# Altium project _A_D.000000.001.PrjPCB
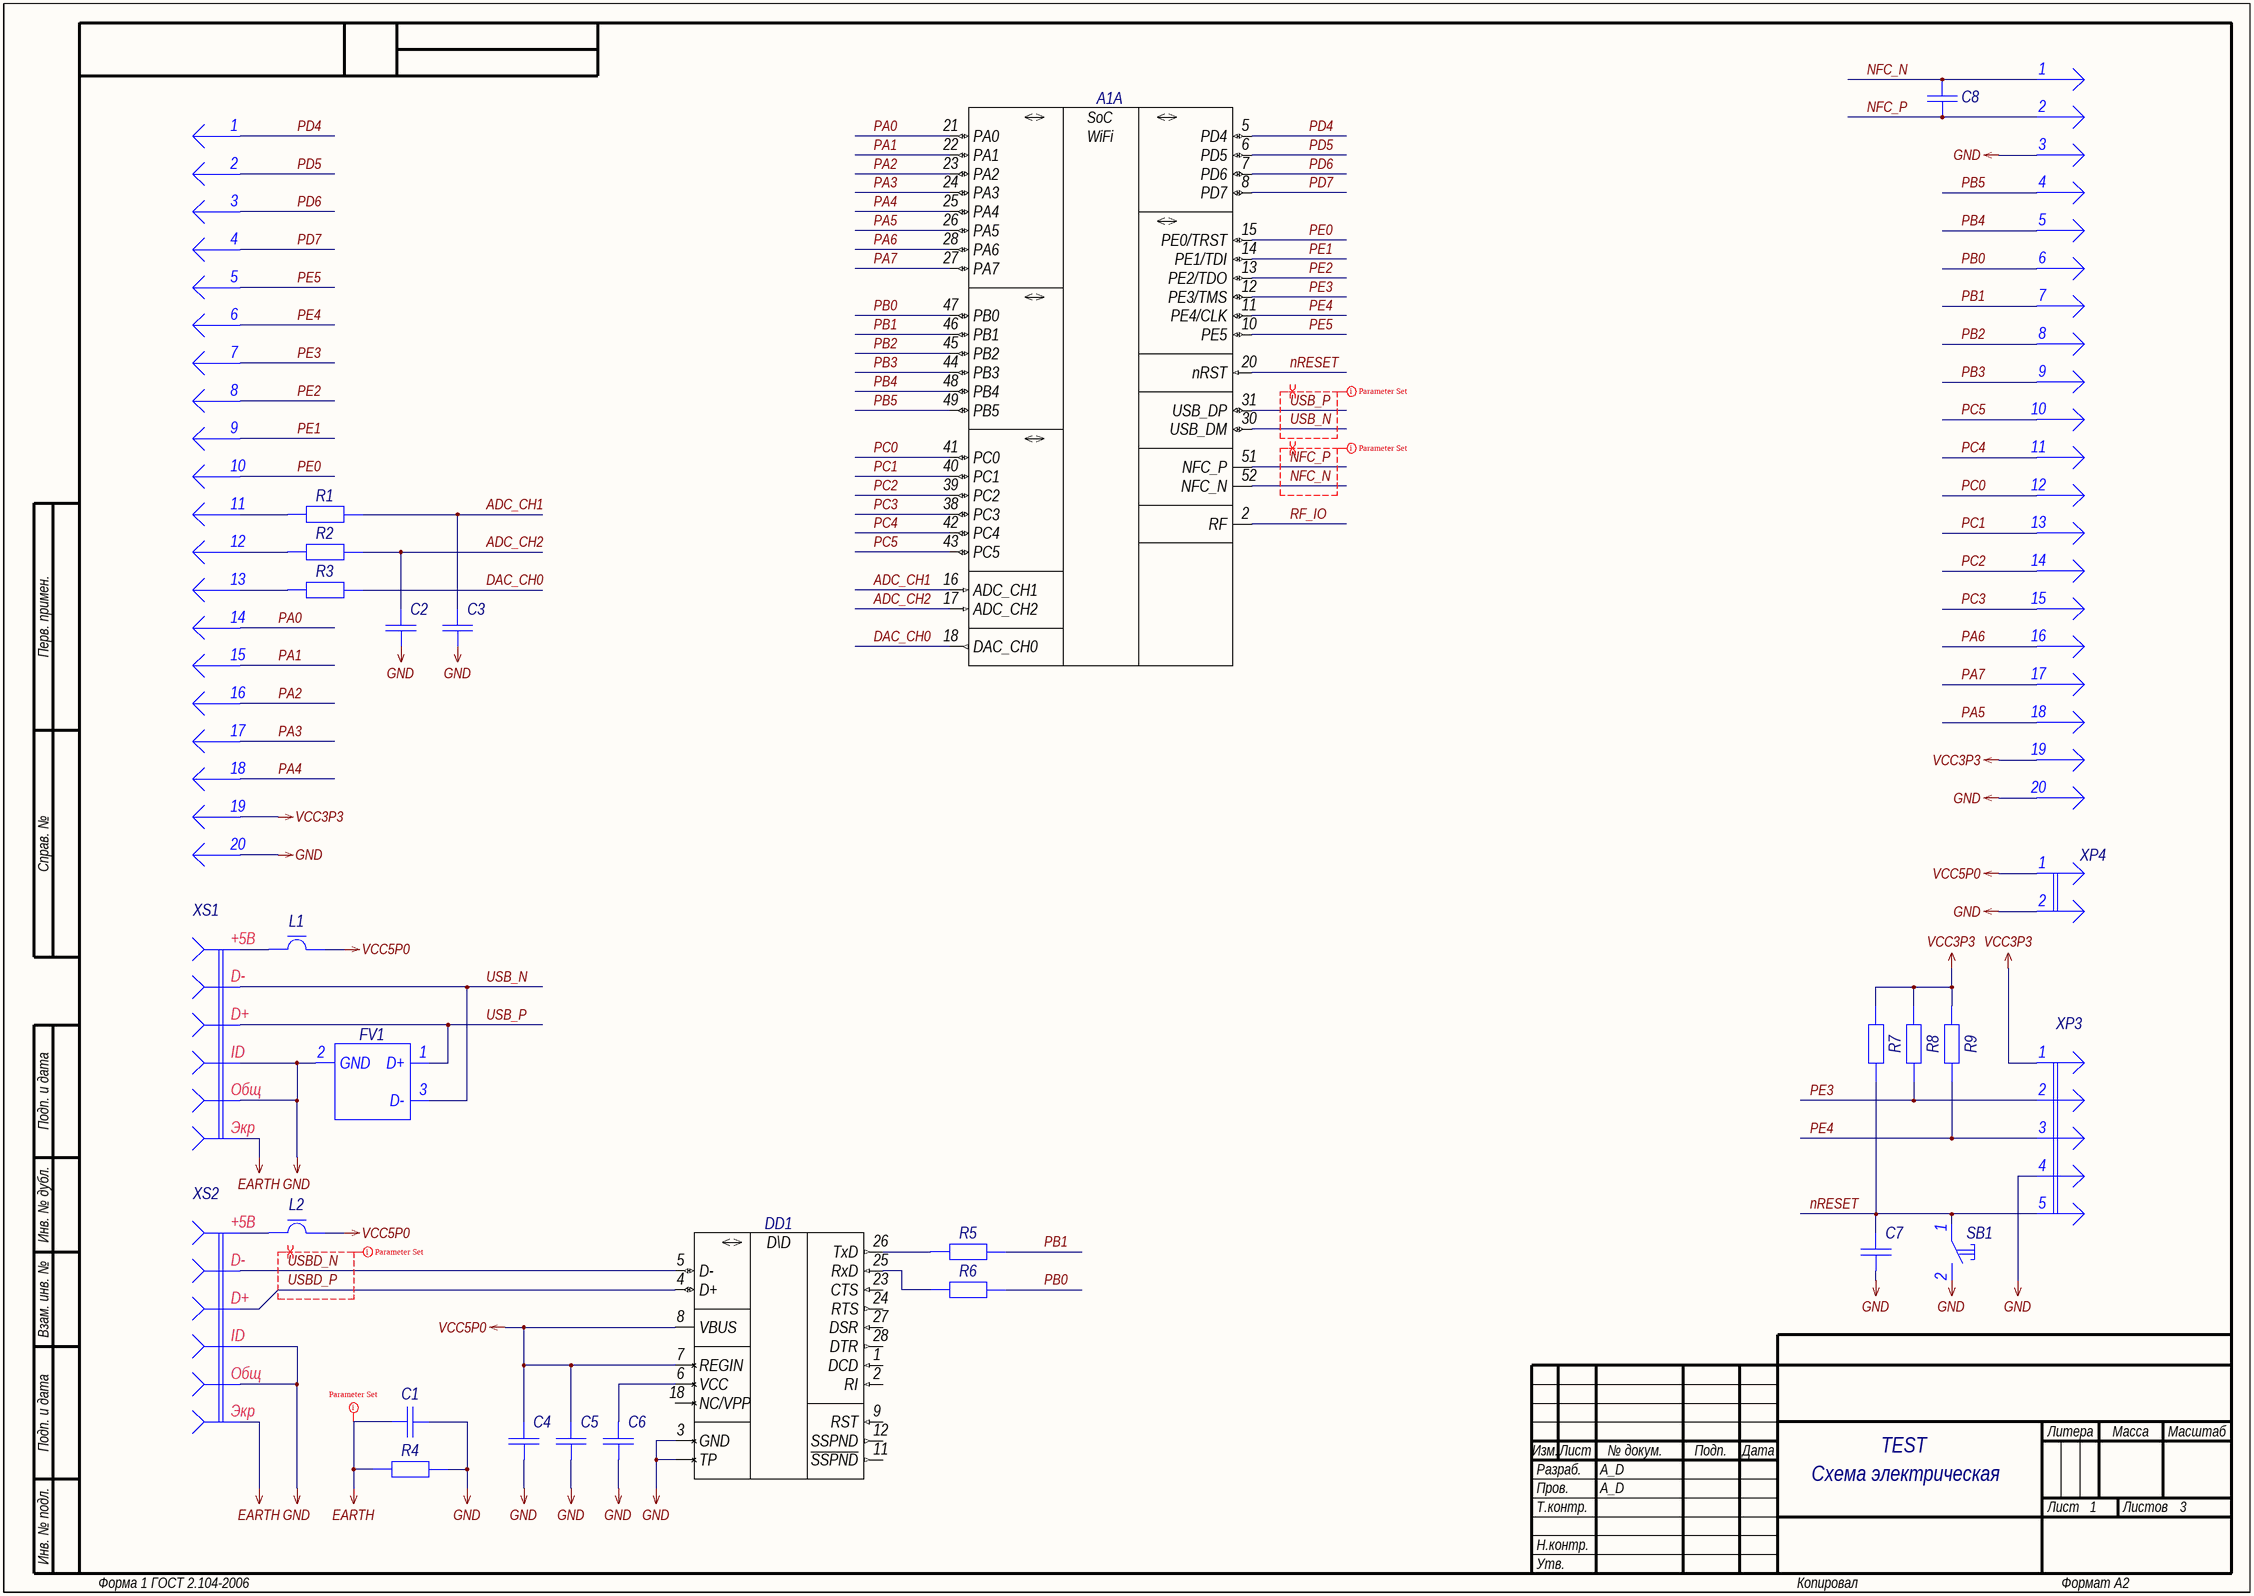
[diagram p0: 01_MAIN.SchDoc]
GlobalOrganizationName: A_D Electronics; GlobalProjectName: TEST; GlobalProjectNumber: A_D.000000.001; GlobalProjectRevision: 1
3 sheets, 81 parts. Net scope: global (net labels, ports and power ports of the same name join across sheets).
Board file: BOARD.PcbDoc
Sheets:
  01_MAIN.SchDoc
  02_ETHERNET.SchDoc
  03_POWER.SchDoc

## Sheet 01_MAIN.SchDoc: =GlobalProjectName
size 594 x 420 mm; CheckedBy: A_D; Author: A_D; Organization: A_D Electronics; DocumentNumber: A_D.000000.001 Э3; Revision: 1; SheetNumber: 1; SheetTotal: 3; PageSetup: Record=PageOptions|CenterHorizontal=True|CenterVertical=True|PrintScale=0.70|XCorrection=1.00|YCorrection=1.00|PrintKind=2|BorderSize=5000000|LeftOffset=9000|BottomOffset=10100|Orientation=2|PaperLength=11176|PaperWidth=8636|Scale=100|PaperSource=259|PrintQuality=-3|MediaType=1|DitherType=10|PrintScaleMode=1|PaperKind=A3|PaperIndex=8; FirstApplication: A_D.000000.001; DocumentName: TEST

### Parts
A1  AMB-02  [AMB-02]  (value not drawn)  (part A of 2)
C1  Capacitor  [C0603_L]  (value not drawn)
C2  Capacitor  [C0603_L]  (value not drawn)
C3  Capacitor  [C0603_L]  (value not drawn)
C4  Capacitor  [C0603_L]  (value not drawn)
C5  Capacitor  [C0603_L]  (value not drawn)
C6  Capacitor  [C0603_L]  (value not drawn)
C7  Capacitor  [C0603_L]  (value not drawn)
C8  Capacitor  [C0603_L]  (value not drawn)
DD1  CP2102_9  [QFN-28_050P500X500X100_N]  (value not drawn)
FV1  TPD2EUSB30DRT  [SOT-3_070P100X080X050_N]  (value not drawn)
L1  FerriteBead  [L0805_L]  (value not drawn)
L2  FerriteBead  [L0805_L]  (value not drawn)
R1  Resistor  [R0603_L]  (value not drawn)
R2  Resistor  [R0603_L]  (value not drawn)
R3  Resistor  [R0603_L]  (value not drawn)
R4  Resistor  [R0603_L]  (value not drawn)
R5  Resistor  [R0603_L]  (value not drawn)
R6  Resistor  [R0603_L]  (value not drawn)
R7  Resistor  [R0603_L]  (value not drawn)
R8  Resistor  [R0603_L]  (value not drawn)
R9  Resistor  [R0603_L]  (value not drawn)
SB1  RESET  [IT-1185AP]  (value not drawn)
XP1  Text  [PLS-20]  (value not drawn)  (parts A,B,C,D,E,F,G,H,I,J,K,L,M,N,O,P,Q,R,S,T of 20)
XP2  Text  [PLS-20]  (value not drawn)  (parts A,B,C,D,E,F,G,H,I,J,K,L,M,N,O,P,Q,R,S,T of 20)
XP3  Text  [PLS-5]  (value not drawn)
XP4  Text  [PLS-2]  (value not drawn)
XS1  Text  [1981568-1]  (value not drawn)
XS2  Text  [1981568-1]  (value not drawn)

### Nets
EARTH: C1.2 R4.1 XS1.6 XS2.6
GND: C1.1 C2.1 C3.1 C4.1 C5.1 C6.1 C7.1 DD1.3(GND) DD1.TP FV1.2(GND) R4.2 SB1.2 XP1.20 XP2.3 XP2.20 XP3.4 XP4.2 XS1.4 XS1.5 XS2.4 XS2.5
VCC3P3: R7.2 R8.2 R9.2 XP1.19 XP2.19 XP3.1
VCC5P0: C4.2 C5.2 DD1.7(REGIN) DD1.8(VBUS) L1.2 L2.2 XP4.1
ADC_CH1: A1.16(ADC_CH1) C3.2 R1.2
ADC_CH2: A1.17(ADC_CH2) C2.2 R2.2
DAC_CH0: A1.18(DAC_CH0) R3.2
NFC_N: A1.52(NFC_N) C8.2 XP2.1
NFC_P: A1.51(NFC_P) C8.1 XP2.2
nRESET: A1.20(nRST) C7.2 R7.1 SB1.1 XP3.5
PA0: A1.21(PA0) XP1.14
PA1: A1.22(PA1) XP1.15
PA2: A1.23(PA2) XP1.16
PA3: A1.24(PA3) XP1.17
PA4: A1.25(PA4) XP1.18
PA5: A1.26(PA5) XP2.18
PA6: A1.28(PA6) XP2.16
PA7: A1.27(PA7) XP2.17
PB0: A1.47(PB0) R6.2 XP2.6
PB1: A1.46(PB1) R5.2 XP2.7
PB2: A1.45(PB2) XP2.8
PB3: A1.44(PB3) XP2.9
PB4: A1.48(PB4) XP2.5
PB5: A1.49(PB5) XP2.4
PC0: A1.41(PC0) XP2.12
PC1: A1.40(PC1) XP2.13
PC2: A1.39(PC2) XP2.14
PC3: A1.38(PC3) XP2.15
PC4: A1.42(PC4) XP2.11
PC5: A1.43(PC5) XP2.10
PD4: A1.5(PD4) XP1.1
PD5: A1.6(PD5) XP1.2
PD6: A1.7(PD6) XP1.3
PD7: A1.8(PD7) XP1.4
PE0: A1.15(PE0/TRST) XP1.10
PE1: A1.14(PE1/TDI) XP1.9
PE2: A1.13(PE2/TDO) XP1.8
PE3: A1.12(PE3/TMS) R8.1 XP1.7 XP3.2
PE4: A1.11(PE4/CLK) R9.1 XP1.6 XP3.3
PE5: A1.10(PE5) XP1.5
RF_IO: A1.2(RF)
USB_N: A1.30(USB_DM) FV1.3(D-) XS1.2
USB_P: A1.31(USB_DP) FV1.1(D+) XS1.3
USBD_N: DD1.5(D-) XS2.2
USBD_P: DD1.4(D+) XS2.3
NetC6_2: C6.2 DD1.6(VCC)
NetDD1_25: DD1.25(RxD) R6.1
NetDD1_26: DD1.26(TxD) R5.1
NetL1_1: L1.1 XS1.1
NetL2_1: L2.1 XS2.1
NetR1_1: R1.1 XP1.11
NetR2_1: R2.1 XP1.12
NetR3_1: R3.1 XP1.13

Not connected (* = marked no-connect by the designer): DD1 1(DCD) 2(RI) 9(RST) 11(~{SSPND}) 12(SSPND) 18(NC/VPP) 23(CTS) 24(RTS) 27(DSR) 28(DTR)

### Layout directives
differential pair: NFC_N, NFC_P, USB_N, USB_P, USBD_N, USBD_P
net class USBD; rule Matched Net Lengths [Tolerance = 1mm]: USBD_N, USBD_P
net class USB; rule Matched Net Lengths [Tolerance = 1mm]: USB_N, USB_P
net class NFC; rule Matched Net Lengths [Tolerance = 1mm]: NFC_N, NFC_P
rule Polygon Connect Style [Style - Direct Connect]: EARTH

### Notes on the sheet
- Схема электрическая
  принципиальная
- Перв. примен.
- Справ. №
- Подп. и дата
- Инв. № дубл.
- Взам. инв. №
- Разраб.
- Изм.
- Лист
- № докум.
- Подп.
- Дата
- Литера
- Масса
- Масштаб
- Пров.
- Т.контр.
- Листов
- Инв. № подл.
- Н.контр.
- Утв.
- Форма 1 ГОСТ 2.104-2006
- Копировал
- Формат А2
- (in symbol 1981568-1) +5В; D-; D+; ID; Общ; Экр
- (in symbol CP2102-GM) D\D
- (in symbol MJIOT-AMB-02, part A) SoC; WiFi

### Library data of the parts
A1 = MJIOT-AMB-02: Manufacturer: MJIOT; ID: 3; Supply Operation: +3.0…3.6V; Supply Current: 450mA; ROM/RAM: 1MB/2MB+512KB; Wireless Compatibility: 802.11 b/g/n; Supported Interfaces: JTAG, SWD, SPI, I2C, I2S, UART, PWM, PCM, SDIO, NFC, ADC, DAC, USB HS, MII/RMII; I/O Lines: 30; Operation Frequency: 166MHz; Application Category: 1; Working Temperature Min: -20°С; Working Temperature Max: +85°С; Published: 12.12.2017; Publisher: Andrew Danich; Type: Модуль; Part Number: MJIOT-AMB-02; Value: MJIOT-AMB-02
C1 C5-C7 = GRM188R72A104KA35D: Manufacturer: Murata; Type: Конденсатор; ID: 232; Value: 0.1uF; Voltage: 100V; Tolerance: ±10%; Dielectric Type: X7R; Application Category: 1; Working Temperature Min: -55°С; Working Temperature Max: +125°С; Published: 18.05.2010; Publisher: Andrew Danich; Part Number: GRM188R72A104KA35D; Footprint: 0603
  C1: ClassName: DirectConnect
C2 C3 = GCM1885C2A101JA16D: Manufacturer: Murata; Type: Конденсатор; ID: 155; Value: 100pF; Voltage: 100V; Tolerance: ±5%; Dielectric Type: NP0; Application Category: 1; Working Temperature Min: -55°С; Working Temperature Max: +125°С; Published: 18.05.2010; Publisher: Andrew Danich; Part Number: GCM1885C2A101JA16D; Footprint: 0603
C4 = GCM188R71E105KA64D: Manufacturer: Murata; Type: Конденсатор; ID: 134; Value: 1uF; Voltage: 25V; Tolerance: ±10%; Dielectric Type: X7R; Application Category: 1; Working Temperature Min: -55°С; Working Temperature Max: +85°С; Published: 18.05.2010; Publisher: Andrew Danich; Part Number: GCM188R71E105KA64D; Footprint: 0603
C8 = GRM1885C2A8R2DA01D: Manufacturer: Murata; Type: Конденсатор; ID: 215; Value: 8.2pF; Voltage: 100V; Tolerance: ±0.5pF; Dielectric Type: NP0; Application Category: 1; Working Temperature Min: -55°С; Working Temperature Max: +125°С; Published: 18.05.2010; Publisher: Andrew Danich; Part Number: GRM1885C2A8R2DA01D; Footprint: 0603
DD1 = CP2102-GM: Single Chip USB to UART Bridge; Manufacturer: Silicon Labs; ID: 4; Supply Operation: +3.3V; Supply Current: 13.7mA; USB Type Support: USB 2.0; USB Speed Support: 12 Mb/s; OTG Support: No; Channels: 1; Working Temperature Min: -40°C; Working Temperature Max: +85°C; Published: 03.08.2015; Publisher: Andrew Danich; Type: Микросхема; Part Number: CP2102-GM; Value: CP2102-GM; Input Interface: UART; Application Category: 1; Functional Analog: -
FV1 = TPD2EUSB30DRT: Manufacturer: Texas Instruments; ID: 5; Breakdown Voltage: 7V; Reverse Stand Off Voltage: 5.5V; Forward Voltage: 0.95V; Peak Forward Current: 5A; Junction Capacitance: 0.8pF; Pulse Power Dissipation: 45W; Directional: Bidirectional; Application Category: 1; Working Temperature Min: -40°С; Working Temperature Max: +85°С; Published: 27.12.2015; Publisher: Andrew Danich; Type: Супрессор; Part Number: TPD2EUSB30DRT; Value: TPD2EUSB30DRT; Functional Analog: -
L1 L2 = BLM21PG331SN1: Manufacturer: Murata; Type: Дроссель; ID: 2; Rated Current: 1.5A; Impedance at 100Mhz: 330ohm; DC Resistance: 0.07ohm; Inductor Type: EMIFIL; Application Category: 1; Working Temperature Min: -55°С; Working Temperature Max: +125°С; Published: 14.11.2014; Publisher: Andrew Danich; Part Number: BLM21PG331SN1; Value: BLM21PG331SN1; Footprint: 0805; ClassName: DirectConnect
R1 R2 = RC0603JR-07100R: Manufacturer: Yageo; ID: 10; Value: 100; Limit Voltage: 50V; Tolerance: ±5%; Temperature Coefficient: 100ppm; Total Power Dissipation: 0.1W; Series Type: Thick-Film; Application Category: 1; Working Temperature Min: -55°С; Working Temperature Max: +155°С; Functional Analog: CR0603-JW-101E; Published: 24.03.2010; Publisher: Andrew Danich; Type: Резистор; Part Number: RC0603JR-07100R; Footprint: 0603
R3 = RC0603JR-070R: Manufacturer: Yageo; ID: 5; Value: 0; Limit Voltage: 50V; Tolerance: ±5%; Temperature Coefficient: 100ppm; Total Power Dissipation: 0.1W; Series Type: Thick-Film; Application Category: 1; Working Temperature Min: -55°С; Working Temperature Max: +155°С; Functional Analog: RC0603FR-070RL, CR0603-J/-000E; Published: 24.03.2010; Publisher: Andrew Danich; Type: Резистор; Part Number: RC0603JR-070R; Footprint: 0603
R4 = RC0603JR-07100KL: Manufacturer: Yageo; ID: 11; Value: 100k; Limit Voltage: 50V; Tolerance: ±5%; Temperature Coefficient: 100ppm; Total Power Dissipation: 0.1W; Series Type: Thick-Film; Application Category: 1; Working Temperature Min: -55°С; Working Temperature Max: +155°С; Functional Analog: CR0603-JW-104E; Published: 24.03.2010; Publisher: Andrew Danich; Type: Резистор; Part Number: RC0603JR-07100KL; Footprint: 0603; ClassName: DirectConnect
R5 R6 = RC0603JR-071KL: Manufacturer: Yageo; ID: 19; Value: 1k; Limit Voltage: 50V; Tolerance: ±5%; Temperature Coefficient: 100ppm; Total Power Dissipation: 0.1W; Series Type: Thick-Film; Application Category: 1; Working Temperature Min: -55°С; Working Temperature Max: +155°С; Functional Analog: CR0603-JW-102E; Published: 24.03.2010; Publisher: Andrew Danich; Type: Резистор; Part Number: RC0603JR-071KL; Footprint: 0603
R7-R9 = RC0603JR-0710KL: Manufacturer: Yageo; ID: 12; Value: 10k; Limit Voltage: 50V; Tolerance: ±5%; Temperature Coefficient: 100ppm; Total Power Dissipation: 0.1W; Series Type: Thick-Film; Application Category: 1; Working Temperature Min: -55°С; Working Temperature Max: +155°С; Functional Analog: CR0603-JW-103E; Published: 24.03.2010; Publisher: Andrew Danich; Type: Резистор; Part Number: RC0603JR-0710KL; Footprint: 0603
SB1 = IT-1185AP: ID: 36; Limit Current: 50mA; Resistance: 0.1ohm; Isolator Resistance: 100meg; Backlight: NO; Number of Contacts: 2; Application Category: 1; Published: 17.04.2014; Publisher: Andrew Danich; Type: Переключатель; Part Number: IT-1185AP; Value: IT-1185AP; Height: 5mm
XP1 XP2 = PLS-20: ID: 26; Value: PLS-20; Limit Voltage: 250V; Limit Current: 3A; Connector Type: Male; Resistance: 15momh; Surface Finish: Gold; Pitch: 2.54mm; Application Category: 1; Published: 24.08.2015; Publisher: Andrew Danich; Type: Вилка; Part Number: PLS-20; Pins: 20
XP3 = PLS-5: Value: PLS-5; ID: 4; Limit Voltage: 250V; Limit Current: 3A; Connector Type: Male; Resistance: 15momh; Surface Finish: Gold; Pitch: 2.54mm; Application Category: 1; Published: 07.03.2013; Publisher: Andrew Danich; Type: Вилка; Part Number: PLS-5; Pins: 5
XP4 = PLS-2: Value: PLS-2; ID: 1; Limit Voltage: 250V; Limit Current: 3A; Connector Type: Male; Resistance: 15momh; Surface Finish: Gold; Pitch: 2.54mm; Published: 07.03.2013; Publisher: Andrew Danich; Type: Вилка; Part Number: PLS-2; Pins: 2; Application Category: 1
XS1 XS2 = 1981568-1: Manufacturer: TE Connectivity; ID: 30; Limit Voltage: 24V; Limit Current: 1A; Connector Type: Female; Interface: USB 2.0; Max Data Rate: 480 mbps; Application Category: 1; Published: 11.04.2016; Publisher: Andrew Danich; Type: Розетка; Part Number: 1981568-1; Value: 1981568-1; Pins: 9; Mount Type: Surface; ClassName: DirectConnect

## Sheet 02_ETHERNET.SchDoc: =GlobalProjectName
size 594 x 420 mm; CheckedBy: A_D; Author: A_D; Organization: A_D Electronics; DocumentNumber: A_D.000000.001 Э3; Revision: 1; SheetNumber: 2; SheetTotal: 3; PageSetup: Record=PageOptions|CenterHorizontal=True|CenterVertical=True|PrintScale=0.70|XCorrection=1.00|YCorrection=1.00|PrintKind=2|BorderSize=5000000|LeftOffset=9000|BottomOffset=10100|Orientation=2|PaperLength=11176|PaperWidth=8636|Scale=100|PaperSource=259|PrintQuality=-3|MediaType=1|DitherType=10|PrintScaleMode=1|PaperKind=A3|PaperIndex=8; FirstApplication: A_D.000000.001; DocumentName: TEST
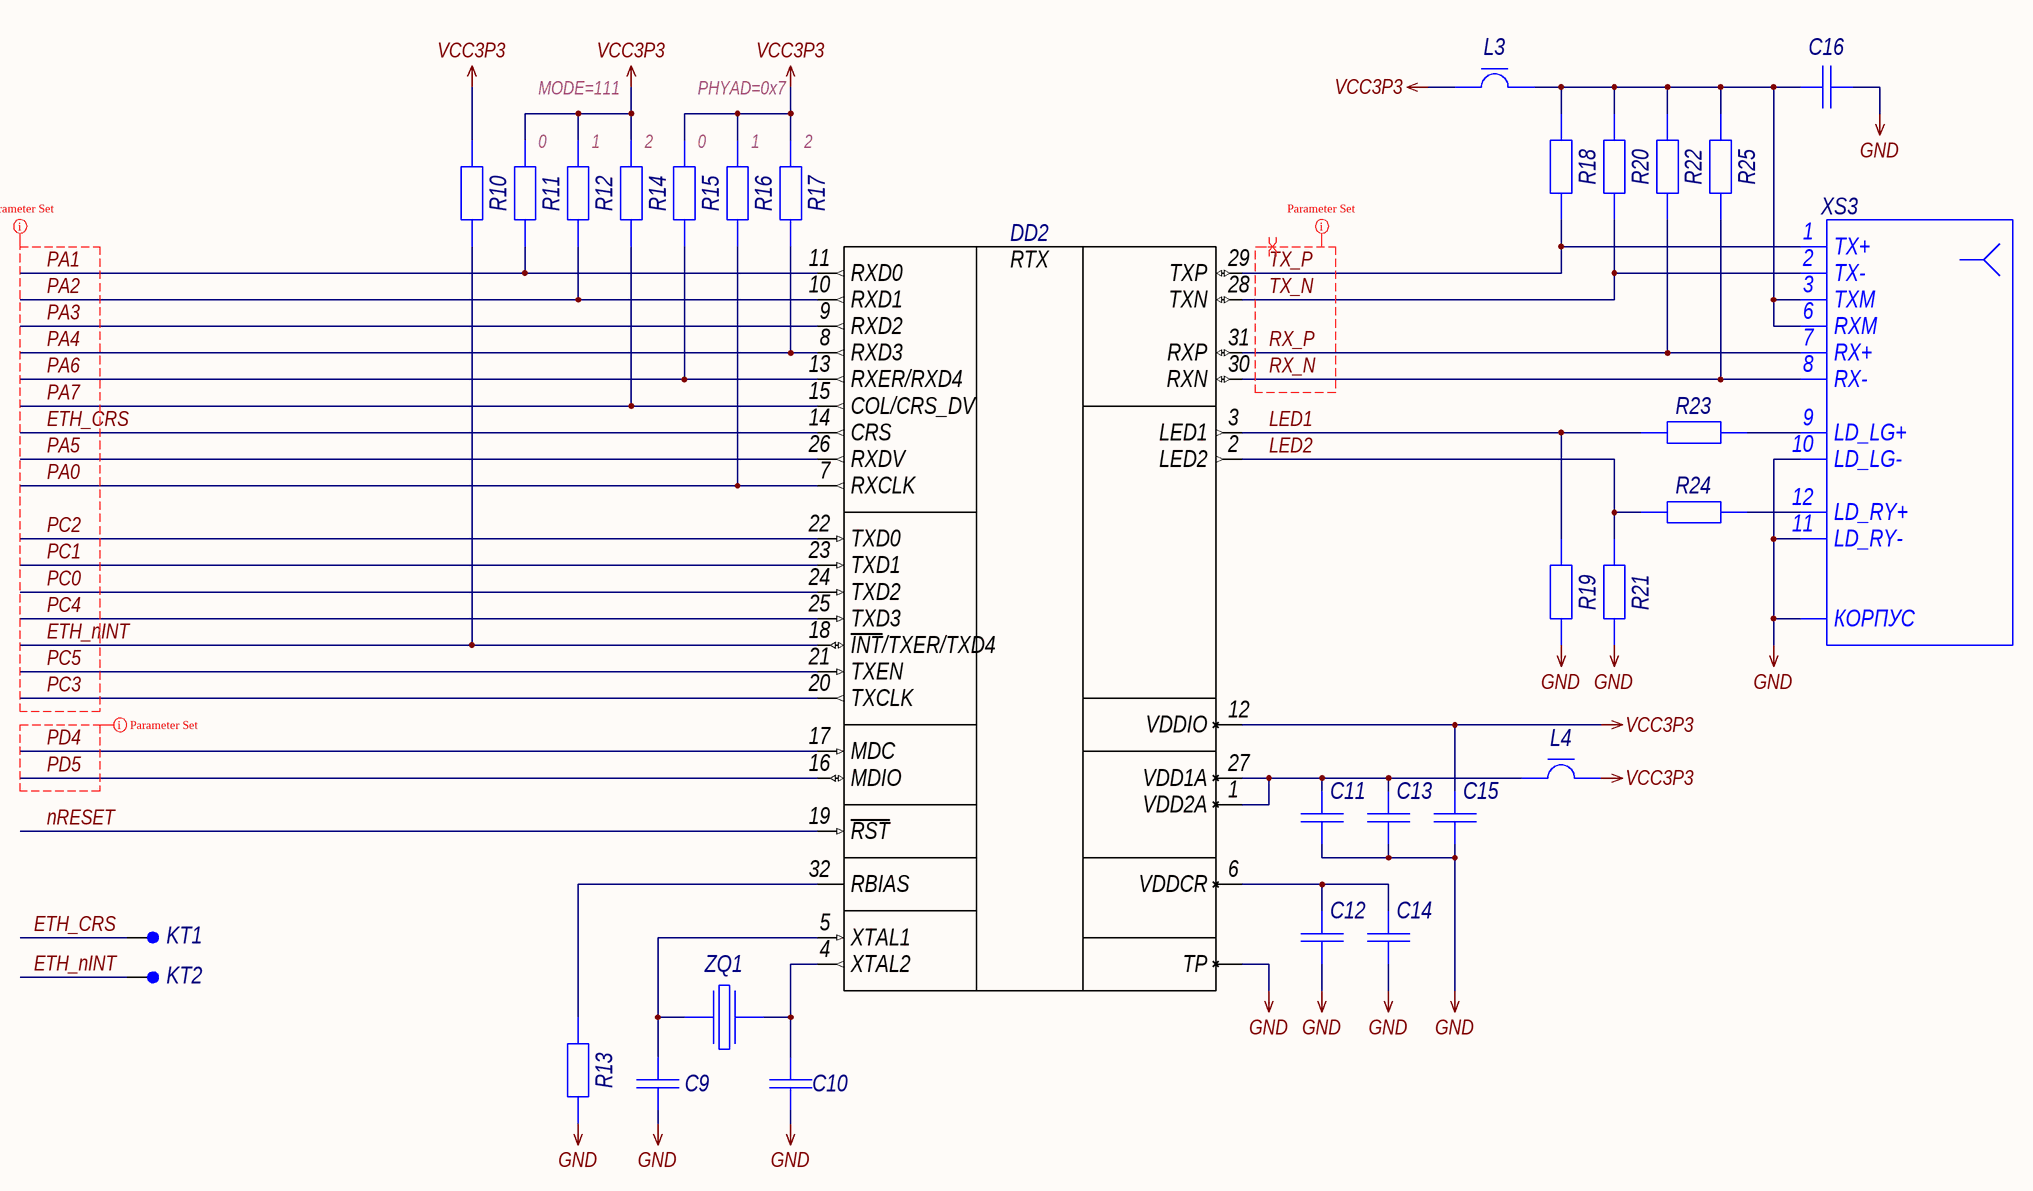
[diagram p1: 02_ETHERNET.SchDoc]

### Parts
C9  Capacitor  [C0603_L]  (value not drawn)
C10  Capacitor  [C0603_L]  (value not drawn)
C11  Capacitor  [C0603_L]  (value not drawn)
C12  Capacitor  [C0603_L]  (value not drawn)
C13  Capacitor  [C0603_L]  (value not drawn)
C14  Capacitor  [C0603_L]  (value not drawn)
C15  Capacitor  [C0603_L]  (value not drawn)
C16  Capacitor  [C0603_L]  (value not drawn)
DD2  LAN8710A-Series  [QFN-32_050P500X500X085_N]  (value not drawn)
KT1  Text  [TP-SMT-C-0.8mm]  (value not drawn)  (no BOM)
KT2  Text  [TP-SMT-C-0.8mm]  (value not drawn)  (no BOM)
L3  FerriteBead  [L0603_L]  (value not drawn)
L4  FerriteBead  [L0603_L]  (value not drawn)
R10  Resistor  [R0603_L]  (value not drawn)
R11  Resistor  [R0603_L]  (value not drawn)
R12  Resistor  [R0603_L]  (value not drawn)
R13  Resistor  [R0603_L]  (value not drawn)
R14  Resistor  [R0603_L]  (value not drawn)
R15  Resistor  [R0603_L]  (value not drawn)
R16  Resistor  [R0603_L]  (value not drawn)
R17  Resistor  [R0603_L]  (value not drawn)
R18  Resistor  [R0603_L]  (value not drawn)
R19  Resistor  [R0603_L]  (value not drawn)
R20  Resistor  [R0603_L]  (value not drawn)
R21  Resistor  [R0603_L]  (value not drawn)
R22  Resistor  [R0603_L]  (value not drawn)
R23  Resistor  [R0603_L]  (value not drawn)
R24  Resistor  [R0603_L]  (value not drawn)
R25  Resistor  [R0603_L]  (value not drawn)
XS3  Text  [SK02-111006NL]  (value not drawn)
ZQ1  Crystal  [SMD 5x3.2mm]  (value not drawn)

### Nets
GND: C9.1 C10.1 C11.1 C12.1 C13.1 C14.1 C15.1 C16.2 DD2.TP R13.1 R19.1 R21.1 XS3.10(LD_LG-) XS3.11(LD_RY-) XS3.CASE(КОРПУС)
VCC3P3: C15.2 DD2.12(VDDIO) L3.1 L4.2 R10.2 R11.2 R12.2 R14.2 R15.2 R16.2 R17.2
ETH_CRS: DD2.14(CRS) KT1.1
ETH_nINT: DD2.18(~{INT}/TXER/TXD4) KT2.1 R10.1
LED1: DD2.3(LED1) R19.2 R23.1
LED2: DD2.2(LED2) R21.2 R24.1
nRESET: DD2.19(~{RST})
PA0: DD2.7(RXCLK) R16.1
PA1: DD2.11(RXD0) R11.1
PA2: DD2.10(RXD1) R12.1
PA3: DD2.9(RXD2)
PA4: DD2.8(RXD3) R17.1
PA5: DD2.26(RXDV)
PA6: DD2.13(RXER/RXD4) R15.1
PA7: DD2.15(COL/CRS_DV) R14.1
PC0: DD2.24(TXD2)
PC1: DD2.23(TXD1)
PC2: DD2.22(TXD0)
PC3: DD2.20(TXCLK)
PC4: DD2.25(TXD3)
PC5: DD2.21(TXEN)
PD4: DD2.17(MDC)
PD5: DD2.16(MDIO)
RX_N: DD2.30(RXN) R25.1 XS3.8(RX-)
RX_P: DD2.31(RXP) R22.1 XS3.7(RX+)
TX_N: DD2.28(TXN) R20.1 XS3.2(TX-)
TX_P: DD2.29(TXP) R18.1 XS3.1(TX+)
NetC9_2: C9.2 DD2.5(XTAL1) ZQ1.1
NetC10_2: C10.2 DD2.4(XTAL2) ZQ1.3
NetC11_2: C11.2 C13.2 DD2.1(VDD2A) DD2.27(VDD1A) L4.1
NetC12_2: C12.2 C14.2 DD2.6(VDDCR)
NetC16_1: C16.1 L3.2 R18.2 R20.2 R22.2 R25.2 XS3.3(TXM) XS3.6(RXM)
NetDD2_32: DD2.32(RBIAS) R13.2
NetR23_2: R23.2 XS3.9(LD_LG+)
NetR24_2: R24.2 XS3.12(LD_RY+)

### Layout directives
net class MII; rule Matched Net Lengths [Tolerance = 2mm]: ETH_CRS, ETH_nINT, PA0, PA1, PA2, PA3, PA4, PA5, PA6, PA7, PC0, PC1, PC2, PC3, PC4, PC5
net class SMI; rule Matched Net Lengths [Tolerance = 2mm]: PD4, PD5
differential pair: RX_N, RX_P, TX_N, TX_P
net class ETH; rule Matched Net Lengths [Tolerance = 1mm]; rule Matched Net Lengths [Tolerance = 2mm]: RX_N, RX_P, TX_N, TX_P

### Notes on the sheet
- MODE=111
- PHYAD=0x7
- (near R11) 0
- (near R12) 1
- (near R14) 2
- (near R15) 0
- (near R16) 1
- (near R17) 2
- Подп. и дата
- Инв. № дубл.
- Взам. инв. №
- Инв. № подл.
- Изм.
- Лист
- № докум.
- Подп.
- Дата
- Форма 2а ГОСТ 2.104-2006
- Копировал
- Формат А2
- (in symbol LAN8710A-EZC) RTX

### Library data of the parts
C9 C10 = GCM1885C2A120JA16D: Manufacturer: Murata; Type: Конденсатор; ID: 121; Value: 12pF; Voltage: 100V; Tolerance: ±5%; Dielectric Type: NP0; Application Category: 1; Working Temperature Min: -55°С; Working Temperature Max: +125°С; Published: 18.05.2010; Publisher: Andrew Danich; Part Number: GCM1885C2A120JA16D; Footprint: 0603
C11 C13 C15 C16 = GRM188R72A104KA35D: as C1 on sheet 01_MAIN; Published: 18.05.2010; Publisher: Andrew Danich; Part Number: GRM188R72A104KA35D; Footprint: 0603
C12 = GCM188R71E105KA64D: as C4 on sheet 01_MAIN; Published: 18.05.2010; Publisher: Andrew Danich; Part Number: GCM188R71E105KA64D; Footprint: 0603
C14 = GRM1885C1H471FA01D: Manufacturer: Murata; Type: Конденсатор; ID: 137; Value: 470pF; Voltage: 50V; Tolerance: ±1%; Dielectric Type: NP0; Application Category: 1; Working Temperature Min: -55°С; Working Temperature Max: +125°С; Published: 18.05.2010; Publisher: Andrew Danich; Part Number: GRM1885C1H471FA01D; Footprint: 0603
DD2 = LAN8710A-EZC: Manufacturer: Microchip; ID: 5; Supply Operation: +3.3V; Ethernet Speed: 10/100BASE-T; Interface: MII, RMII; Application Category: 1; Working Temperature Min: 0°С; Working Temperature Max: +85°С; Functional Analog: LAN8710A-EZC-ABC, LAN8710Ai-EZK; Type: Микросхема; Published: 01.09.2018; Publisher: Andrew Danich; Part Number: LAN8710A-EZC; Value: LAN8710A-EZC
KT1 KT2 = TestPoint-SMT: ID: 6; Application Type: On PCB Test Point; Application Category: 1; Published: 03.03.2015; Publisher: Andrew Danich; Part Number: TestPoint-SMT; Value: TestPoint-SMT; Manufacturer: -; Functional Analog: -
L3 L4 = BLM18PG331SN1: Manufacturer: Murata; Type: Дроссель; ID: 1; Rated Current: 1.2A; Impedance at 100Mhz: 330ohm; DC Resistance: 0.15ohm; Inductor Type: EMIFIL; Working Temperature Min: -55°С; Working Temperature Max: +125°С; Published: 14.11.2014; Publisher: Andrew Danich; Part Number: BLM18PG331SN1; Value: BLM18PG331SN1; Footprint: 0603; Application Category: 1
R10-R12 R14-R17 R19 R21 = RC0603JR-0710KL: as R7 on sheet 01_MAIN; Published: 24.03.2010; Publisher: Andrew Danich; Type: Резистор; Part Number: RC0603JR-0710KL; Footprint: 0603
R13 = RC0603FR-0712KL: Manufacturer: Yageo; ID: 323; Value: 12k; Limit Voltage: 50V; Tolerance: ±1%; Temperature Coefficient: 100ppm; Total Power Dissipation: 0.1W; Series Type: Thick-Film; Application Category: 1; Working Temperature Min: -55°С; Working Temperature Max: +155°С; Published: 24.03.2010; Publisher: Andrew Danich; Type: Резистор; Part Number: RC0603FR-0712KL; Footprint: 0603
R18 R20 R22 R25 = RC0603FR-0749R9L: Manufacturer: Yageo; ID: 249; Value: 49.9; Limit Voltage: 50V; Tolerance: ±1%; Temperature Coefficient: 100ppm; Total Power Dissipation: 0.1W; Series Type: Thick-Film; Application Category: 1; Working Temperature Min: -55°С; Working Temperature Max: +155°С; Functional Analog: CR0603-FX-49R9E; Published: 24.03.2010; Publisher: Andrew Danich; Type: Резистор; Part Number: RC0603FR-0749R9L; Footprint: 0603
R23 R24 = RC0603JR-07270RL: Manufacturer: Yageo; ID: 36; Value: 270; Limit Voltage: 50V; Tolerance: ±5%; Temperature Coefficient: 100ppm; Total Power Dissipation: 0.1W; Series Type: Thick-Film; Application Category: 1; Working Temperature Min: -55°С; Working Temperature Max: +155°С; Published: 24.03.2010; Publisher: Andrew Danich; Type: Резистор; Part Number: RC0603JR-07270RL; Footprint: 0603
XS3 = SK02-111006NL: Manufacturer: Sanken Electric Co., Ltd; ID: 18; Limit Voltage: 125V; Limit Current: 1.5A; Connector Type: Female; Interface: Ethernet/Int.Trans.; Max Data Rate: 10/100Mbs; Application Category: 1; Working Temperature Min: -40°С; Working Temperature Max: +70°С; Value: SK02-111006NL; Published: 08.09.2014; Publisher: Andrew Danich; Type: Розетка; Part Number: SK02-111006NL; Pins: 12; Mount Type: Through hole; Functional Analog: -
ZQ1 = AB-25.000MAGE-T: Manufacturer: TXC Corporation; ID: 26; Output Frequency: 25MHz; Load Capacitance: 12pF; Temperature Coefficient: ±30ppm; Application Category: 1; Working Temperature Min: -40°С; Working Temperature Max: +85°С; Published: 08.03.2013; Publisher: Andrew Danich; Type: Резонатор; Part Number: AB-25.000MAGE-T; Value: AB-25.000MAGE-T

## Sheet 03_POWER.SchDoc: =GlobalProjectName
size 594 x 420 mm; CheckedBy: A_D; Author: A_D; Organization: A_D Electronics; DocumentNumber: A_D.000000.001 Э3; Revision: 1; SheetNumber: 3; SheetTotal: 3; PageSetup: Record=PageOptions|CenterHorizontal=True|CenterVertical=True|PrintScale=0.70|XCorrection=1.00|YCorrection=1.00|PrintKind=2|BorderSize=5000000|LeftOffset=9000|BottomOffset=10100|Orientation=2|PaperLength=11176|PaperWidth=8636|Scale=100|PaperSource=259|PrintQuality=-3|MediaType=1|DitherType=10|PrintScaleMode=1|PaperKind=A3|PaperIndex=8; FirstApplication: A_D.000000.001; DocumentName: TEST
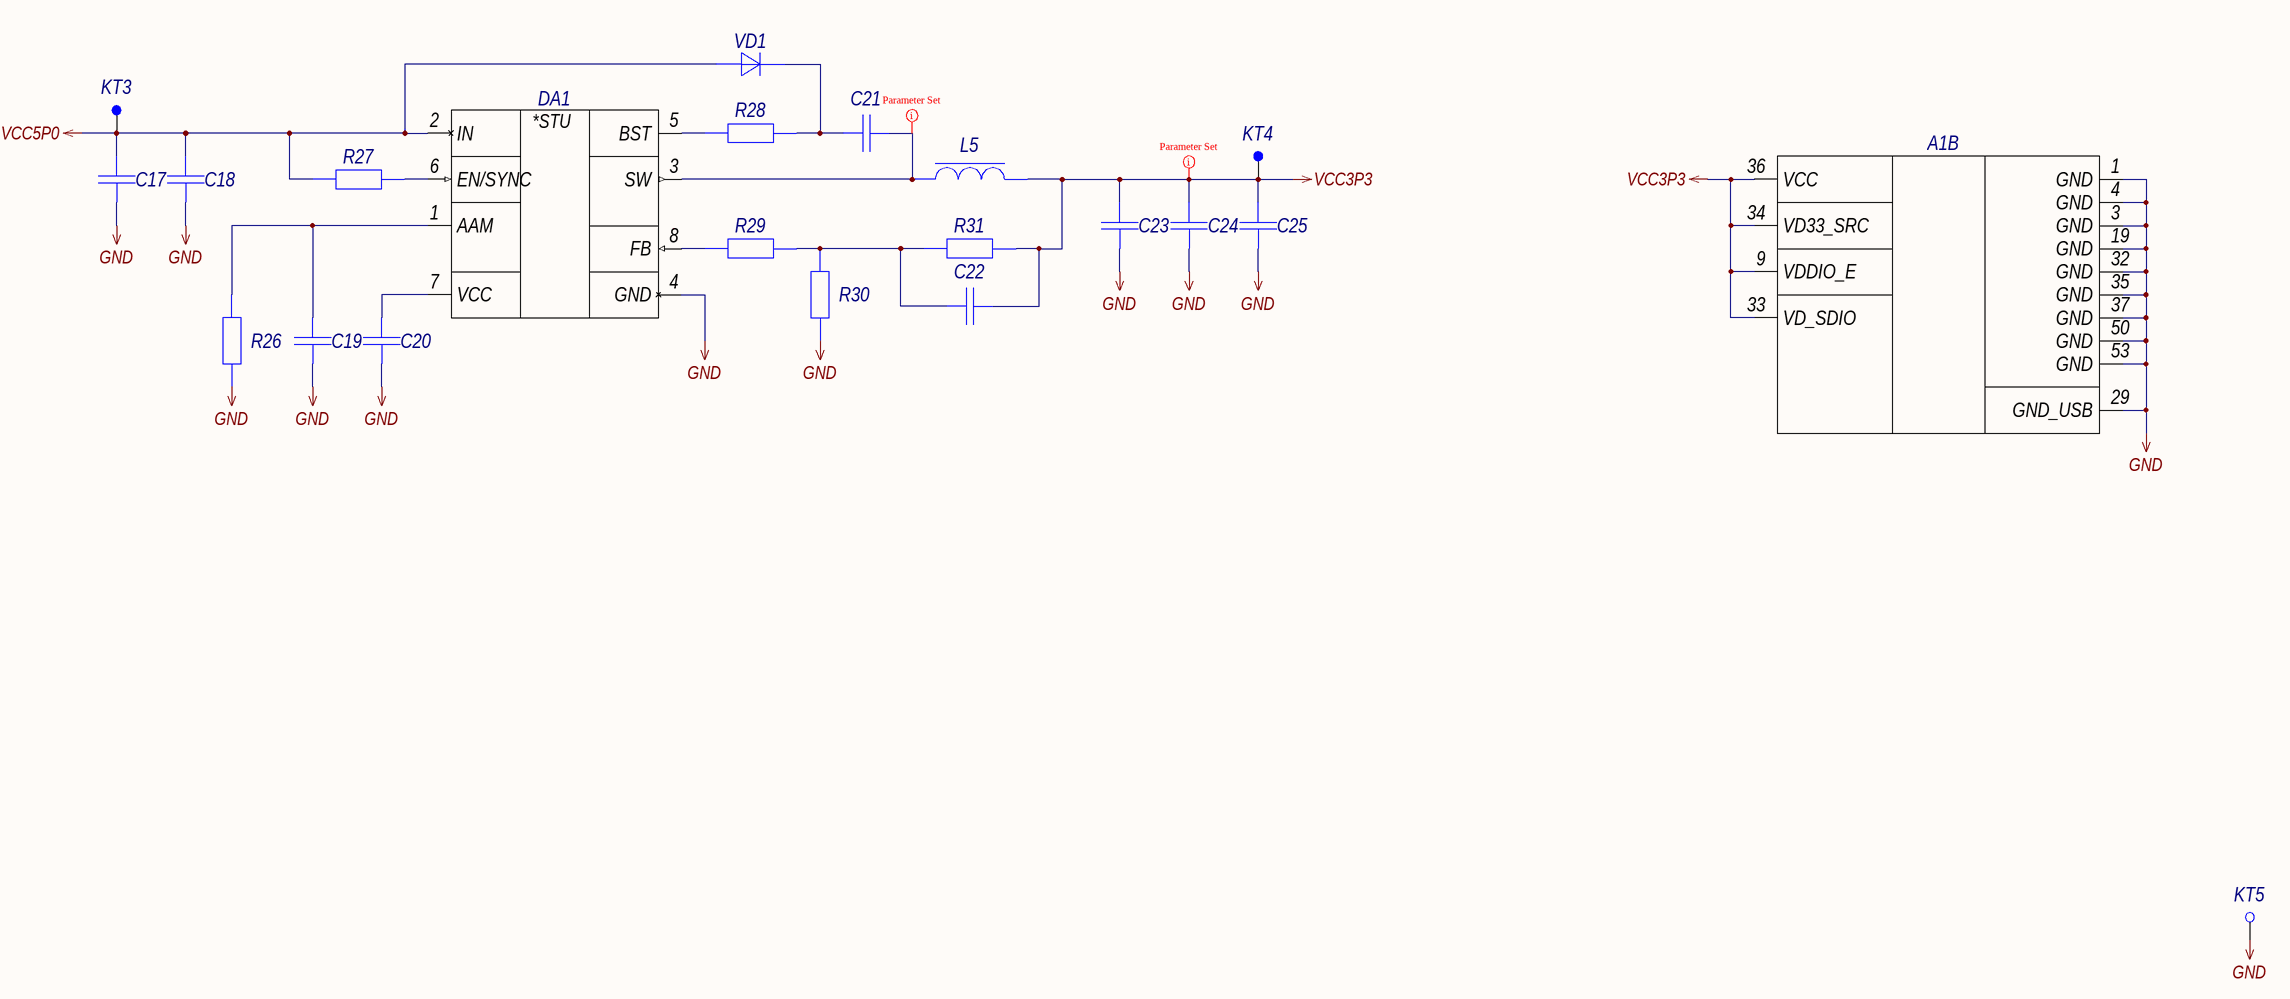
[diagram p2: 03_POWER.SchDoc]

### Parts
A1  AMB-02  [AMB-02]  (value not drawn)  (part B of 2)
C17  Capacitor  [C0805_L]  (value not drawn)
C18  Capacitor  [C0603_L]  (value not drawn)
C19  Capacitor  [C0603_L]  (value not drawn)
C20  Capacitor  [C0603_L]  (value not drawn)
C21  Capacitor  [C0603_L]  (value not drawn)
C22  Capacitor  [C0603_L]  (value not drawn)
C23  Capacitor  [C0805_L]  (value not drawn)
C24  Capacitor  [C0805_L]  (value not drawn)
C25  Capacitor  [C0805_L]  (value not drawn)
DA1  MP2315GJ  [TSOT-23-8_065P290X160X100_N]  (value not drawn)
KT3  +5V  [TP-SMT-C-0.8mm]  (value not drawn)  (no BOM)
KT4  +3.3V  [TP-SMT-C-0.8mm]  (value not drawn)  (no BOM)
KT5  GND  [5001]  (value not drawn)  (no BOM)
L5  Coil  [SRP4020TA-Series]  (value not drawn)
R26  Resistor  [R0603_L]  (value not drawn)
R27  Resistor  [R0603_L]  (value not drawn)
R28  Resistor  [R0603_L]  (value not drawn)
R29  Resistor  [R0603_L]  (value not drawn)
R30  Resistor  [R0603_L]  (value not drawn)
R31  Resistor  [R0603_L]  (value not drawn)
VD1  Diode  [SOD-323]  (value not drawn)

### Nets
GND: A1.1(GND) A1.3(GND) A1.4(GND) A1.19(GND) A1.29(GND_USB) A1.32(GND) A1.35(GND) A1.37(GND) A1.50(GND) A1.53(GND) C17.1 C18.1 C19.1 C20.1 C23.1 C24.1 C25.1 DA1.4(GND) KT5.1 R26.1 R30.1
VCC3P3: A1.9(VDDIO_E) A1.33(VD_SDIO) A1.34(VD33_SRC) A1.36(VCC) C22.2 C23.2 C24.2 C25.2 KT4.1 L5.2 R31.2
VCC5P0: C17.2 C18.2 DA1.2(IN) KT3.1 R27.1 VD1.1(А)
NetC19_2: C19.2 DA1.1(AAM) R26.2
NetC20_2: C20.2 DA1.7(VCC)
NetC21_1: C21.1 R28.2 VD1.2(К)
NetC21_2: C21.2 DA1.3(SW) L5.1
NetC22_1: C22.1 R29.2 R30.2 R31.1
NetDA1_5: DA1.5(BST) R28.1
NetDA1_6: DA1.6(EN/SYNC) R27.2
NetDA1_8: DA1.8(FB) R29.1

### Layout directives
rule Polygon Connect Style [Style - Direct Connect]: NetC21_2, VCC3P3

### Notes on the sheet
- Подп. и дата
- Инв. № дубл.
- Взам. инв. №
- Инв. № подл.
- Изм.
- Лист
- № докум.
- Подп.
- Дата
- Форма 2а ГОСТ 2.104-2006
- Копировал
- Формат А2
- (in symbol MP2315GJ-Z) *STU

### Library data of the parts
A1 = MJIOT-AMB-02: as A1 on sheet 01_MAIN; Published: 12.12.2017; Publisher: Andrew Danich; Type: Модуль; Part Number: MJIOT-AMB-02; Value: MJIOT-AMB-02
C17 C23-C25 = GRM21BR60J226ME39L: Manufacturer: Murata; Type: Конденсатор; ID: 140; Value: 22uF; Voltage: 6.3V; Tolerance: ±20%; Dielectric Type: X5R; Application Category: 1; Working Temperature Min: -55°С; Working Temperature Max: +85°С; Published: 18.05.2010; Publisher: Andrew Danich; Part Number: GRM21BR60J226ME39L; Footprint: 0805; ClassName: DirectConnect
C18 C20 C21 = GRM188R72A104KA35D: as C1 on sheet 01_MAIN; Published: 18.05.2010; Publisher: Andrew Danich; Part Number: GRM188R72A104KA35D; Footprint: 0603
  C18: ClassName: DirectConnect
C19 = GRM1885C2A102JA01D: Manufacturer: Murata; Type: Конденсатор; ID: 135; Value: 1000pF; Voltage: 100V; Tolerance: ±5%; Dielectric Type: NP0; Application Category: 1; Working Temperature Min: -55°С; Working Temperature Max: +125°С; Published: 18.05.2010; Publisher: Andrew Danich; Part Number: GRM1885C2A102JA01D; Footprint: 0603
C22 = GRM1885C1H330JA01D: Manufacturer: Murata; Type: Конденсатор; ID: 123; Value: 33pF; Voltage: 50V; Tolerance: ±5%; Dielectric Type: NP0; Application Category: 1; Working Temperature Min: -55°С; Working Temperature Max: +125°С; Published: 18.05.2010; Publisher: Andrew Danich; Part Number: GRM1885C1H330JA01D; Footprint: 0603
DA1 = MP2315GJ-Z: Manufacturer: Monolithic Power Systems; ID: 38; Input Voltage: +4.5…24V; Output Current: 3A; Output Voltage: +0.8…22.8V; Shutdown Input: YES; Frequency: 500kHz; Application Category: 1; Working Temperature Min: -40°С; Working Temperature Max: +125°С; Functional Analog: MP2315GJ-P; Type: Микросхема; Published: 01.09.2018; Publisher: Andrew Danich; Part Number: MP2315GJ-Z; Value: MP2315GJ-Z; ClassName: DirectConnect
KT3 KT4 = TestPoint-SMT: as KT1 on sheet 02_ETHERNET; Published: 03.03.2015; Publisher: Andrew Danich; Part Number: TestPoint-SMT; Value: TestPoint-SMT; Manufacturer: -; Functional Analog: -
KT5 = 5001: Manufacturer: Keystone Electronics; ID: 2; Value: 5001; Limit Voltage: 100V; Rated Current: 0.5A; Application Type: Miniature THM Test Point; Application Category: 1; Published: 03.03.2015; Publisher: Andrew Danich; Part Number: 5001; Functional Analog: -
L5 = SRP4020TA-4R7M: Manufacturer: Bourns; Type: Дроссель; ID: 103; Rated Current: 2.6A; Tolerance: ±20%; Inductance: 4.7uH; Q: 10; DC Resistance: 0.105ohm; Self-Resonant Frequency: 27MHz; Application Category: 1; Working Temperature Min: -40°С; Working Temperature Max: +125°С; Published: 20.05.2010; Publisher: Andrew Danich; Part Number: SRP4020TA-4R7M; Value: SRP4020TA-4R7M; Footprint: SRP4020TA; ClassName: DirectConnect
R26 = RC0603FR-0763K4L: Manufacturer: Yageo; ID: 468; Value: 63.4k; Limit Voltage: 50V; Tolerance: ±1%; Temperature Coefficient: 100ppm; Total Power Dissipation: 0.1W; Series Type: Thick-Film; Application Category: 1; Working Temperature Min: -55°С; Working Temperature Max: +155°С; Published: 24.03.2010; Publisher: Andrew Danich; Type: Резистор; Part Number: RC0603FR-0763K4L; Footprint: 0603
R27 = RC0603JR-07100KL: as R4 on sheet 01_MAIN; Published: 24.03.2010; Publisher: Andrew Danich; Type: Резистор; Part Number: RC0603JR-07100KL; Footprint: 0603
R28 = RC0603JR-0720RL: Manufacturer: Yageo; ID: 469; Value: 20; Limit Voltage: 50V; Tolerance: ±5%; Temperature Coefficient: 100ppm; Total Power Dissipation: 0.1W; Series Type: Thick-Film; Application Category: 1; Working Temperature Min: -55°С; Working Temperature Max: +155°С; Published: 24.03.2010; Publisher: Andrew Danich; Type: Резистор; Part Number: RC0603JR-0720RL; Footprint: 0603
R29 = RC0603JR-0733KL: Manufacturer: Yageo; ID: 47; Value: 33k; Limit Voltage: 50V; Tolerance: ±5%; Temperature Coefficient: 100ppm; Total Power Dissipation: 0.1W; Series Type: Thick-Film; Application Category: 1; Working Temperature Min: -55°С; Working Temperature Max: +155°С; Published: 24.03.2010; Publisher: Andrew Danich; Type: Резистор; Part Number: RC0603JR-0733KL; Footprint: 0603
R30 = RC0603FR-0712K7L: Manufacturer: Yageo; ID: 263; Value: 12.7k; Limit Voltage: 50V; Tolerance: ±1%; Temperature Coefficient: 100ppm; Total Power Dissipation: 0.1W; Series Type: Thick-Film; Application Category: 1; Working Temperature Min: -55°С; Working Temperature Max: +155°С; Published: 24.03.2010; Publisher: Andrew Danich; Type: Резистор; Part Number: RC0603FR-0712K7L; Footprint: 0603
R31 = RC0603FR-0740K2L: Manufacturer: Yageo; ID: 294; Value: 40.2k; Limit Voltage: 50V; Tolerance: ±1%; Temperature Coefficient: 100ppm; Total Power Dissipation: 0.1W; Series Type: Thick-Film; Application Category: 1; Working Temperature Min: -55°С; Working Temperature Max: +155°С; Published: 24.03.2010; Publisher: Andrew Danich; Type: Резистор; Part Number: RC0603FR-0740K2L; Footprint: 0603
VD1 = 1N4148WS-7-F: Manufacturer: Diodes Incorporated; Type: Диод; ID: 13; Reverse Voltage: 100V; Reverse Current: 1uA; Forward Voltage: 1V; Forward Current: 150mA; Total Power Dissipation: 200mW; Capacitance: 2pF; Recovery Time: 4nS; Application Category: 1; Working Temperature Min: -55°С; Working Temperature Max: +150°С; Published: 18.05.2010; Publisher: Andrew Danich; Part Number: 1N4148WS-7-F; Value: 1N4148WS-7-F; Functional Analog: 1N4148WS

## Nets that join several sheets
GND: 01_MAIN (21 pins), 02_ETHERNET (15 pins), 03_POWER (21 pins)
VCC3P3: 01_MAIN (6 pins), 02_ETHERNET (11 pins), 03_POWER (11 pins)
VCC5P0: 01_MAIN (7 pins), 03_POWER (6 pins)
nRESET: 01_MAIN (5 pins), 02_ETHERNET (DD2.19)
PA0: 01_MAIN (A1.21 XP1.14), 02_ETHERNET (DD2.7 R16.1)
PA1: 01_MAIN (A1.22 XP1.15), 02_ETHERNET (DD2.11 R11.1)
PA2: 01_MAIN (A1.23 XP1.16), 02_ETHERNET (DD2.10 R12.1)
PA3: 01_MAIN (A1.24 XP1.17), 02_ETHERNET (DD2.9)
PA4: 01_MAIN (A1.25 XP1.18), 02_ETHERNET (DD2.8 R17.1)
PA5: 01_MAIN (A1.26 XP2.18), 02_ETHERNET (DD2.26)
PA6: 01_MAIN (A1.28 XP2.16), 02_ETHERNET (DD2.13 R15.1)
PA7: 01_MAIN (A1.27 XP2.17), 02_ETHERNET (DD2.15 R14.1)
PC0: 01_MAIN (A1.41 XP2.12), 02_ETHERNET (DD2.24)
PC1: 01_MAIN (A1.40 XP2.13), 02_ETHERNET (DD2.23)
PC2: 01_MAIN (A1.39 XP2.14), 02_ETHERNET (DD2.22)
PC3: 01_MAIN (A1.38 XP2.15), 02_ETHERNET (DD2.20)
PC4: 01_MAIN (A1.42 XP2.11), 02_ETHERNET (DD2.25)
PC5: 01_MAIN (A1.43 XP2.10), 02_ETHERNET (DD2.21)
PD4: 01_MAIN (A1.5 XP1.1), 02_ETHERNET (DD2.17)
PD5: 01_MAIN (A1.6 XP1.2), 02_ETHERNET (DD2.16)